# EAGLE schematic QuantumEntanglement (EAGLE 7.5.0)
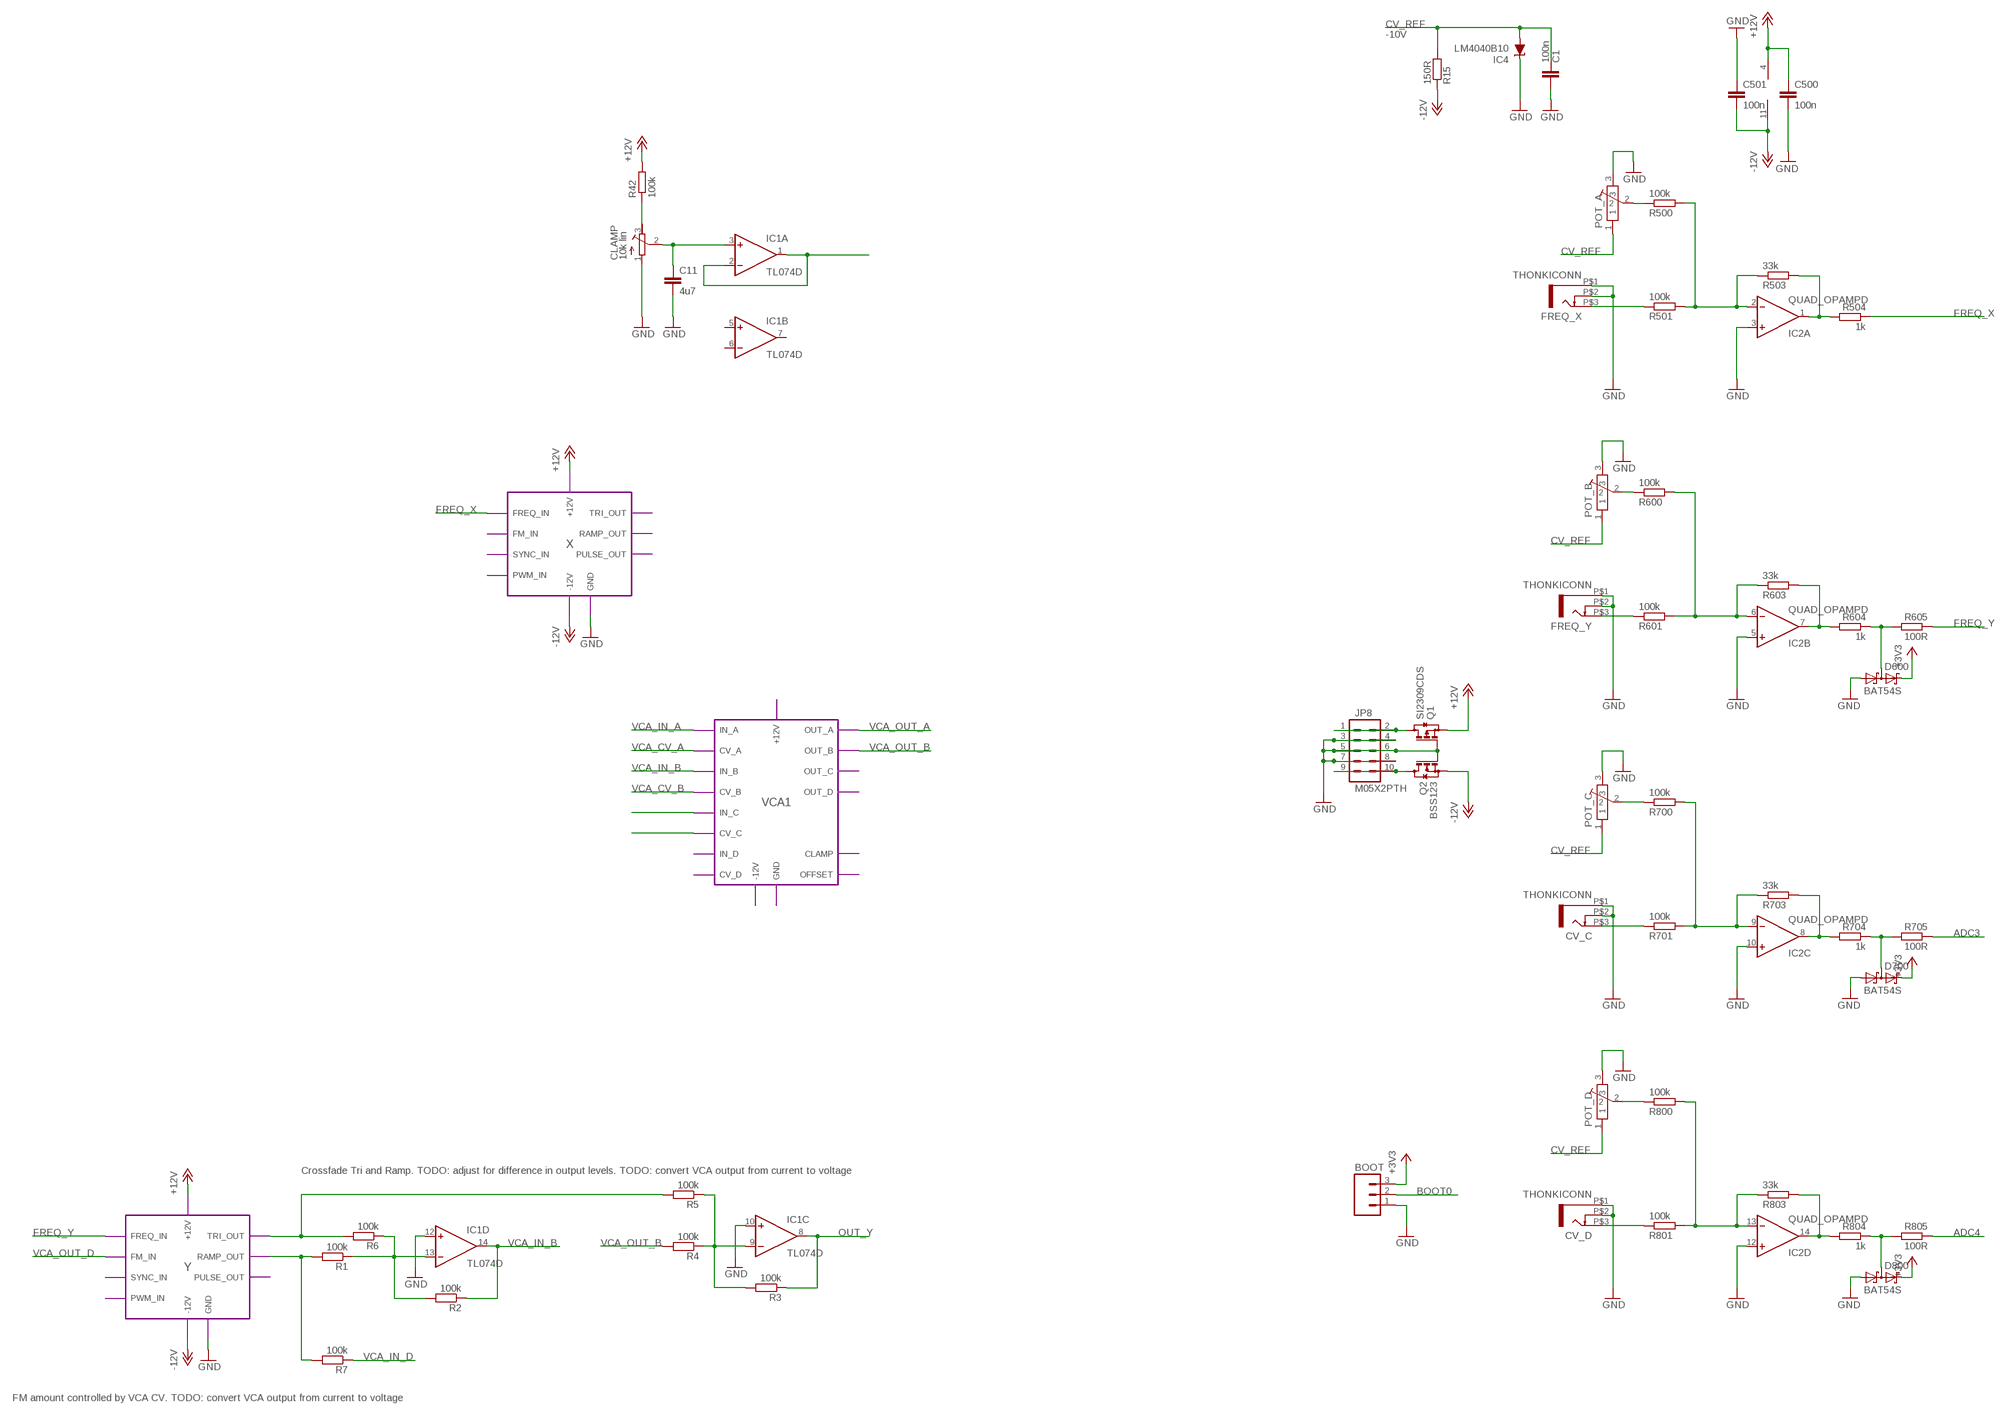
[diagram p0: schematic, sheet 1]

## Parts
BOOT  M03PTH  [1X03]
C1  100n  C-EUC0603  [C0603]
C11  4u7  C-EUC0603K  [C0603K]
C500  100n  C-EUC0603  [C0603]
C501  100n  C-EUC0603  [C0603]
CLAMP  10k lin  R-TRIMM64W  [RTRIM64W]
CV_C  THONKICONN  [THONKICONN]
CV_D  THONKICONN  [THONKICONN]
D600  BAT54S  [SOT23]
D700  BAT54S  [SOT23]
D800  BAT54S  [SOT23]
FREQ_X  THONKICONN  [THONKICONN]
FREQ_Y  THONKICONN  [THONKICONN]
IC1  TL074D  [SO14]
IC2  QUAD_OPAMPD  [SO14]
IC4  LM4040B10  LM4041C12DBZ  [DBZ_R-PDSO-G3]
JP8  M05X2PTH  [AVR_ICSP]
POT_A  POT-ALPS-RK09L1140  [POT-ALPS-RK09L1140]
POT_B  POT-ALPS-RK09L1140  [POT-ALPS-RK09L1140]
POT_C  POT-ALPS-RK09L1140  [POT-ALPS-RK09L1140]
POT_D  POT-ALPS-RK09L1140  [POT-ALPS-RK09L1140]
Q1  SI2309CDS  BSS84  [SOT23]
Q2  BSS123  [SOT23]
R1  100k  R-EU_0603  [0603]
R2  100k  R-EU_0603  [0603]
R3  100k  R-EU_0603  [0603]
R4  100k  R-EU_0603  [0603]
R5  100k  R-EU_0603  [0603]
R6  100k  R-EU_0603  [0603]
R7  100k  R-EU_0603  [0603]
R15  150R  R-EU_0603  [0603]
R42  100k  R-EU_0603  [0603]
R500  100k  R-EU_0603  [0603]
R501  100k  R-EU_0603  [0603]
R503  33k  R-EU_0603  [0603]
R504  1k  R-EU_0603  [0603]
R600  100k  R-EU_0603  [0603]
R601  100k  R-EU_0603  [0603]
R603  33k  R-EU_0603  [0603]
R604  1k  R-EU_0603  [0603]
R605  100R  R-EU_0603  [0603]
R700  100k  R-EU_0603  [0603]
R701  100k  R-EU_0603  [0603]
R703  33k  R-EU_0603  [0603]
R704  1k  R-EU_0603  [0603]
R705  100R  R-EU_0603  [0603]
R800  100k  R-EU_0603  [0603]
R801  100k  R-EU_0603  [0603]
R803  33k  R-EU_0603  [0603]
R804  1k  R-EU_0603  [0603]
R805  100R  R-EU_0603  [0603]

## Module instances
X = VCO
Y = VCO
VCA1 = VCA

## Nets
+3V3: BOOT.3 D600.2(C2) D700.2(C2) D800.2(C2)
+12V: C500.1 IC2.4(P:V+) Q1.2(S) R42.2 ; port X.+12V Y.+12V
-12V: C501.2 IC2.11(P:V-) Q2.2(S) R15.1 ; port X.-12V Y.-12V
ADC3: R705.1
ADC4: R805.1
BOOT0: BOOT.2
CLAMP_REF: IC1.1(A:OUT) IC1.2(A:-IN)
CV_REF: C1.1 IC4.2(A) POT_A.1 POT_B.1 POT_C.1 POT_D.1 R15.2
FREQ_X: R504.1 ; port X.FREQ_IN
FREQ_Y: R605.1 ; port Y.FREQ_IN
GND: BOOT.1 C1.2 C11.2 C500.2 C501.1 CLAMP.1(A) CV_C.P$1 CV_C.P$2 CV_D.P$1 CV_D.P$2 D600.1(A1) D700.1(A1) D800.1(A1) FREQ_X.P$1 FREQ_X.P$2 FREQ_Y.P$1 FREQ_Y.P$2 IC1.10(C:+IN) IC1.12(D:+IN) IC2.3(A:+IN) IC2.5(B:+IN) IC2.10(C:+IN) IC2.12(D:+IN) IC4.1(C) JP8.3 JP8.4 JP8.5 JP8.6 JP8.7 JP8.8 POT_A.3 POT_B.3 POT_C.3 POT_D.3 Q1.1(G) Q2.1(G) ; port X.GND Y.GND
N$1: R1.2 R7.2 ; port Y.RAMP_OUT
N$2: IC1.13(D:-IN) R1.1 R2.2 R6.1
N$3: FREQ_X.P$3 R501.1
N$5: IC1.9(C:-IN) R3.2 R4.1 R5.1
N$6: IC2.9(C:-IN) R700.2 R701.2 R703.1
N$8: JP8.9 JP8.10 Q2.3(D)
N$10: R5.2 R6.2 ; port Y.TRI_OUT
N$12: JP8.1 JP8.2 Q1.3(D)
N$13: IC2.2(A:-IN) R500.2 R501.2 R503.1
N$14: POT_A.2 R500.1
N$16: port VCA1.IN_C
N$17: IC2.1(A:OUT) R503.2 R504.2
N$18: port VCA1.CV_C
N$19: FREQ_Y.P$3 R601.1
N$20: IC2.6(B:-IN) R600.2 R601.2 R603.1
N$21: POT_B.2 R600.1
N$22: IC2.7(B:OUT) R603.2 R604.2
N$23: D600.3(C1A2) R604.1 R605.2
N$25: CV_C.P$3 R701.1
N$27: POT_C.2 R700.1
N$28: IC2.8(C:OUT) R703.2 R704.2
N$29: D700.3(C1A2) R704.1 R705.2
N$31: CV_D.P$3 R801.1
N$33: IC2.13(D:-IN) R800.2 R801.2 R803.1
N$34: POT_D.2 R800.1
N$35: IC2.14(D:OUT) R803.2 R804.2
N$36: D800.3(C1A2) R804.1 R805.2
N$44: CLAMP.3(E) R42.1
N$78: C11.1 CLAMP.2(S) IC1.3(A:+IN)
OUT_Y: IC1.8(C:OUT) R3.1
VCA_CV_A: port VCA1.CV_A
VCA_CV_B: port VCA1.CV_B
VCA_IN_A: port VCA1.IN_A
VCA_IN_B: IC1.14(D:OUT) R2.1 ; port VCA1.IN_B
VCA_IN_D: R7.1
VCA_OUT_A: port VCA1.OUT_A
VCA_OUT_B: R4.2 ; port VCA1.OUT_B
VCA_OUT_D: port Y.FM_IN
Unconnected: IC1.5(B:+IN) IC1.6(B:-IN) IC1.7(B:OUT) POT_A.P$5 POT_A.P$6 POT_B.P$5 POT_B.P$6 POT_C.P$5 POT_C.P$6 POT_D.P$5 POT_D.P$6

## Notes on the sheet
- -10V
- Crossfade Tri and Ramp. TODO: adjust for difference in output levels. TODO: convert VCA output from current to voltage
- FM amount controlled by VCA CV. TODO: convert VCA output from current to voltage

## Power pins joined to a net without a drawn wire
V+: IC1.4(P:V+)
V-: IC1.11(P:V-)

## Library data of the parts
BOOT = SparkFun:M03: Header 3 Standard 3-pin 0.1" header. Use with straight break away headers (SKU : PRT-00116), right angle break away headers (PRT-00553), swiss pins (PRT-00743), machine pins (PRT-00117), and female headers (PRT-00115). Molex polarized connector foot print use with SKU : PRT-08232 with associated crimp pins and housings.
C1 C11 C500 C501 = resistor:C-EU: CAPACITOR, European symbol
CLAMP = resistor:R-TRIMM: Trimm resistor
CV_C CV_D FREQ_X FREQ_Y = Rebel:THONKICONN
D600 D700 D800 = diode:BAT54S: Schottky Diodes Pin connection corrected 2011-05-04 Source: Fairchild .. BAT54.pdf
IC1 = linear:TL074: OP AMP
IC2 = adafruit:QUAD_OPAMP: OP AMP Standard quad package
IC4 = texas:LM4041: PRECISION MICROPOWER SHUNT VOLTAGE REFERENCE Source: http://focus.ti.com/lit/ds/slcs146e/slcs146e.pdf; MF: TEXAS INSTRUMENT CONNECTORS; MPN: LM4041C12QDBZT; OC_FARNELL: 1771733; OC_NEWARK: 43K3376
JP8 = SparkFun:M05X2: Header 5x2 Standard 10-pin dual row 0.1" header. Commonly used with AVR-ISP. Use with Spark Fun Electronics SKU: PRT-00778
POT_A POT_B POT_C POT_D = Rebel:POT-ALPS-RK09L
Q1 = transistor-small-signal:BSS84: P-CHANNEL MOS FET; OC_FARNELL: 1779264
Q2 = transistor-small-signal:BSS123: N-CHANNEL MOS FET; OC_FARNELL: 1843725
R1-R7 R15 R42 R500 R501 R503 R504 R600 R601 R603-R605 R700 R701 R703-R705 R800 R801 R803-R805 = Rebel:R-EU_: RESISTOR, European symbol

## Module VCO
Ports: FREQ_IN(io) FM_IN(io) SYNC_IN(io) PWM_IN(io) TRI_OUT(io) RAMP_OUT(io) PULSE_OUT(io) -12V(pwr) +12V(pwr) GND(pwr)
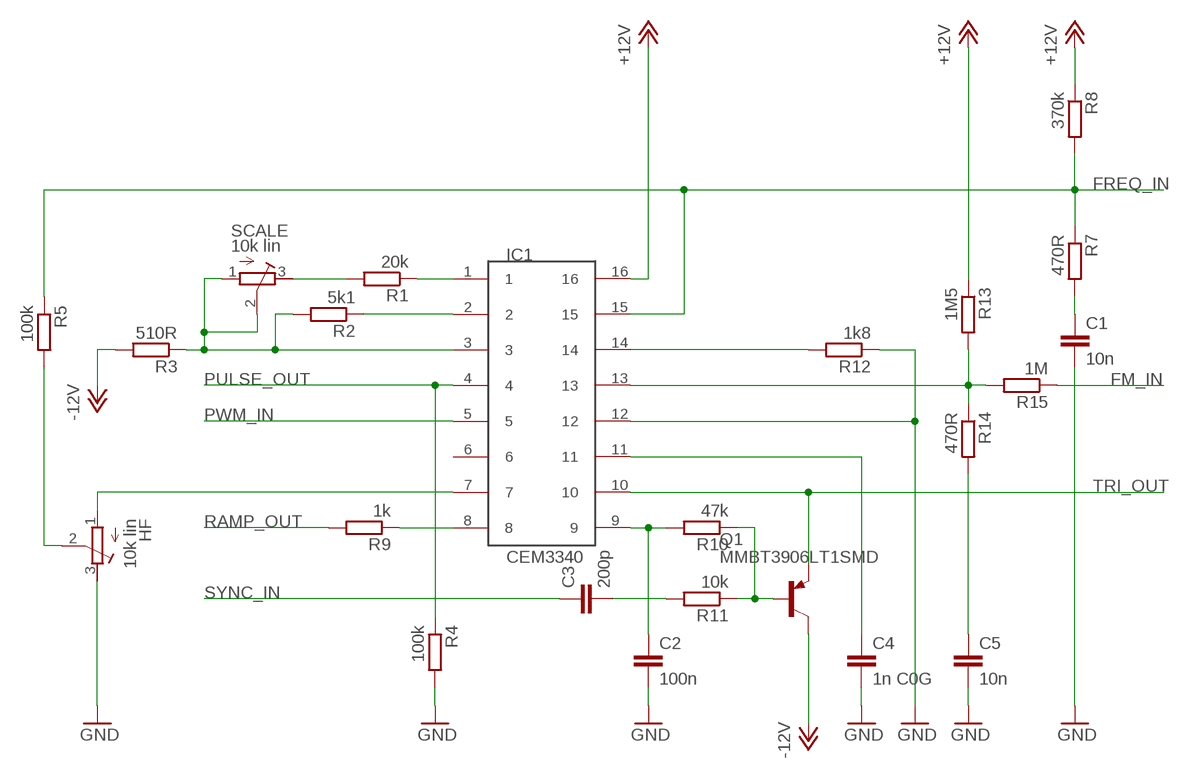
[diagram p1: schematic, module VCO, sheet 1]

### Parts
C1  10n  C-EUC0603K  [C0603K]
C2  100n  C-EUC0603K  [C0603K]
C3  200p  C-EUC0603K  [C0603K]
C4  1n C0G  C-EUC0603K  [C0603K]
C5  10n  C-EUC0603K  [C0603K]
HF  10k lin  R-TRIMM64W  [RTRIM64W]
IC1  CEM3340  [SOIC16N]
Q1  MMBT3906LT1SMD  [SOT23-BEC]
R1  20k  R-EU_0603  [0603]
R2  5k1  R-EU_0603  [0603]
R3  510R  R-EU_0603  [0603]
R4  100k  R-EU_0603  [0603]
R5  100k  R-EU_0603  [0603]
R7  470R  R-EU_0603  [0603]
R8  370k  R-EU_0603  [0603]
R9  1k  R-EU_0603  [0603]
R10  47k  R-EU_0603  [0603]
R11  10k  R-EU_0603  [0603]
R12  1k8  R-EU_0603  [0603]
R13  1M5  R-EU_0603  [0603]
R14  470R  R-EU_0603  [0603]
R15  1M  R-EU_0603  [0603]
SCALE  10k lin  R-TRIMM64W  [RTRIM64W]

### Nets
+12V: IC1.16 R8.1 R13.1
-12V: Q1.C R3.2
FM_IN: R15.1
FREQ_IN: IC1.15 R5.1 R7.1 R8.2
GND: C1.2 C2.2 C4.2 C5.2 HF.3(E) IC1.12 R4.2 R12.1
N$1: IC1.1 R1.1
N$2: R1.2 SCALE.3(E)
N$3: HF.1(A) IC1.7
N$4: IC1.2 R2.1
N$5: IC1.3 R2.2 R3.1 SCALE.1(A) SCALE.2(S)
N$6: HF.2(S) R5.2
N$9: C1.1 R7.2
N$10: IC1.8 R9.1
N$11: C2.1 IC1.9 R10.2
N$12: Q1.B R10.1 R11.1
N$13: C3.2 R11.2
N$14: C4.1 IC1.11
N$16: IC1.14 R12.2
N$17: IC1.13 R13.2 R14.1 R15.2
N$18: C5.1 R14.2
PULSE_OUT: IC1.4 R4.1
PWM_IN: IC1.5
RAMP_OUT: R9.2
SYNC_IN: C3.1
TRI_OUT: IC1.10 Q1.E
Unconnected: IC1.6

### Library data of the parts
C1-C5 = resistor:C-EU: CAPACITOR, European symbol
HF SCALE = resistor:R-TRIMM: Trimm resistor
IC1 = Rebel:CEM3340: CEM3340 VCO
Q1 = transistor-pnp:MMBT3906*: PNP Transistror
R1-R5 R7-R15 = Rebel:R-EU_: RESISTOR, European symbol

## Module VCA
Ports: IN_A(in) CV_A(in) IN_B(in) CV_B(in) IN_C(in) CV_C(in) IN_D(in) CV_D(in) OUT_A(out) OUT_B(out) OUT_C(out) OUT_D(out) CLAMP(io) OFFSET(io) +12V(pwr) -12V(pwr) GND(pwr)
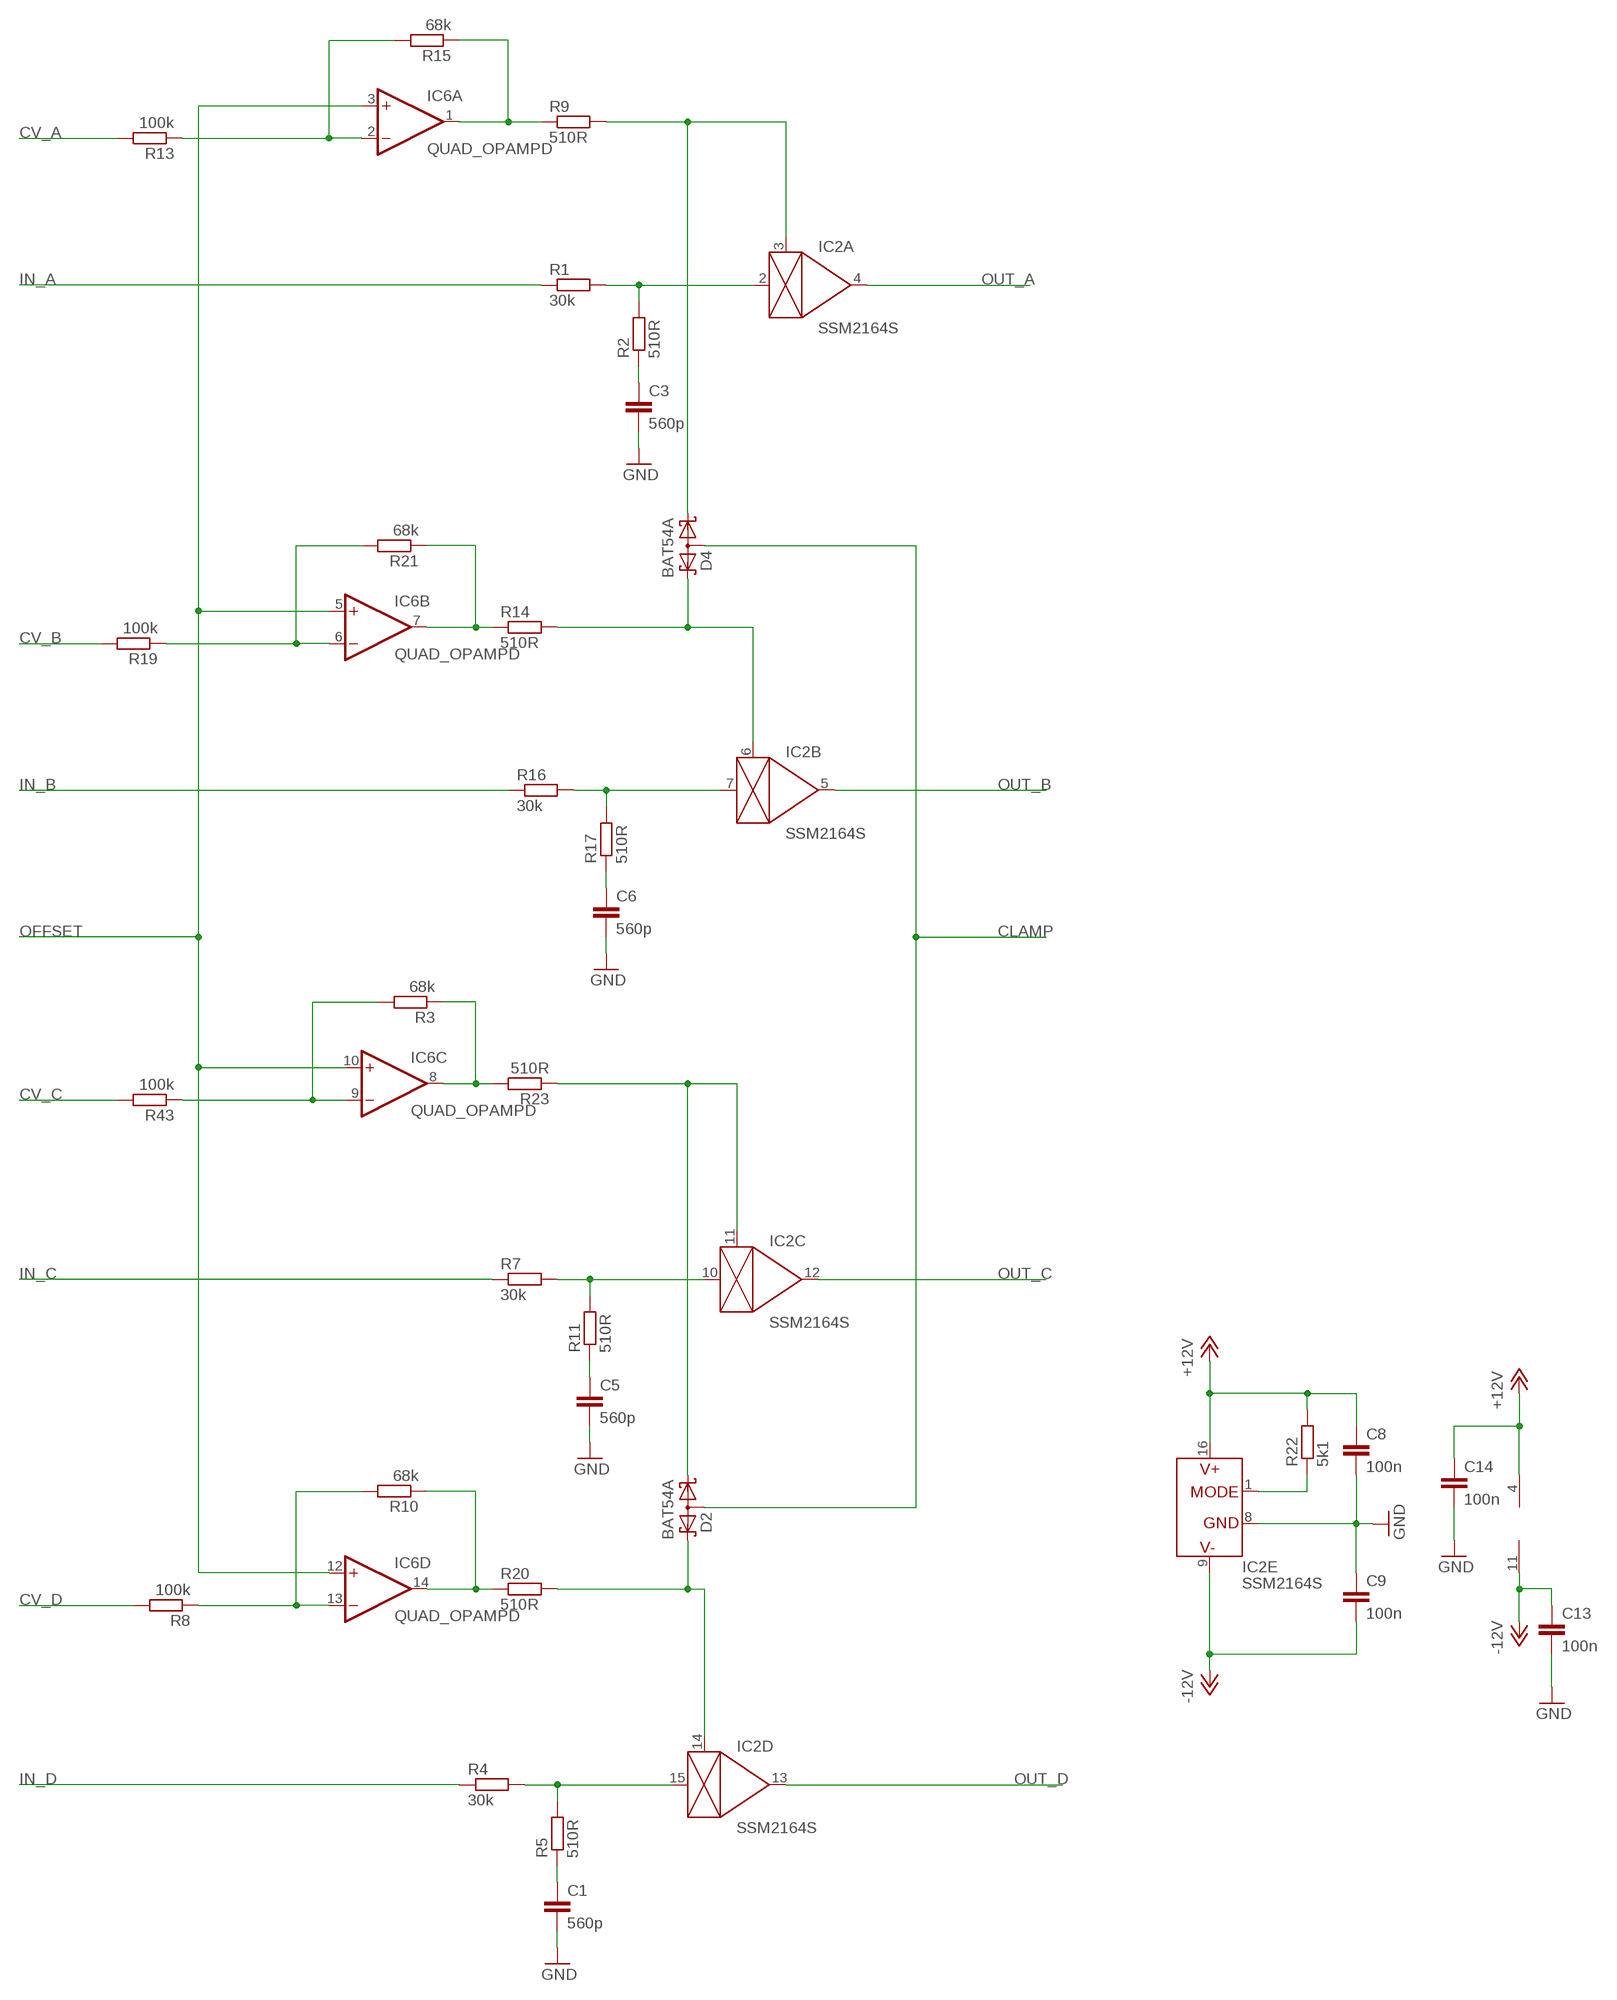
[diagram p2: schematic, module VCA, sheet 1]

### Parts
C1  560p  C-EUC0603K  [C0603K]
C3  560p  C-EUC0603K  [C0603K]
C5  560p  C-EUC0603K  [C0603K]
C6  560p  C-EUC0603K  [C0603K]
C8  100n  C-EUC0603K  [C0603K]
C9  100n  C-EUC0603K  [C0603K]
C13  100n  C-EUC0603K  [C0603K]
C14  100n  C-EUC0603K  [C0603K]
D2  BAT54A  [SOT23]
D4  BAT54A  [SOT23]
IC2  SSM2164S  [SOIC16N]
IC6  QUAD_OPAMPD  [SO14]
R1  30k  R-EU_0603  [0603]
R2  510R  R-EU_0603  [0603]
R3  68k  R-EU_0603  [0603]
R4  30k  R-EU_0603  [0603]
R5  510R  R-EU_0603  [0603]
R7  30k  R-EU_0603  [0603]
R8  100k  R-EU_0603  [0603]
R9  510R  R-EU_0603  [0603]
R10  68k  R-EU_0603  [0603]
R11  510R  R-EU_0603  [0603]
R13  100k  R-EU_0603  [0603]
R14  510R  R-EU_0603  [0603]
R15  68k  R-EU_0603  [0603]
R16  30k  R-EU_0603  [0603]
R17  510R  R-EU_0603  [0603]
R19  100k  R-EU_0603  [0603]
R20  510R  R-EU_0603  [0603]
R21  68k  R-EU_0603  [0603]
R22  5k1  R-EU_0603  [0603]
R23  510R  R-EU_0603  [0603]
R43  100k  R-EU_0603  [0603]

### Nets
+12V: C8.1 C14.1 IC2.16(E:V+) IC6.4(P:V+) R22.2
-12V: C9.2 C13.1 IC2.9(E:V-) IC6.11(P:V-)
CLAMP: D2.3(AA) D4.3(AA)
CV_A: R13.2
CV_B: R19.2
CV_C: R43.2
CV_D: R8.2
GND: C1.2 C3.2 C5.2 C6.2 C8.2 C9.1 C13.2 C14.2 IC2.8(E:GND)
IC2_1: IC6.14(D:OUT) R10.1 R20.1
IC2_2: IC6.13(D:-IN) R8.1 R10.2
IC2_3: IC6.1(A:OUT) R9.1 R15.1
IC2_4: IC6.9(C:-IN) R3.2 R43.1
IC2_5: IC6.2(A:-IN) R13.1 R15.2
IC2_6: IC6.7(B:OUT) R14.1 R21.1
IC2_7: IC6.6(B:-IN) R19.1 R21.2
IC2_11: IC6.8(C:OUT) R3.1 R23.2
IN_A: R1.1
IN_B: R16.1
IN_C: R7.1
IN_D: R4.1
N$1: D4.1(K1) IC2.3(A:CTRL) R9.2
N$2: C1.1 R5.1
N$3: C3.1 R2.1
N$4: IC2.15(D:IN) R4.2 R5.2
N$5: IC2.2(A:IN) R1.2 R2.2
N$7: D4.2(K2) IC2.6(B:CTRL) R14.2
N$8: D2.1(K1) IC2.11(C:CTRL) R23.1
N$11: C6.1 R17.1
N$12: IC2.7(B:IN) R16.2 R17.2
N$14: D2.2(K2) IC2.14(D:CTRL) R20.2
N$17: IC2.1(E:MODE) R22.1
N$19: C5.1 R11.1
N$23: IC2.10(C:IN) R7.2 R11.2
OFFSET: IC6.3(A:+IN) IC6.5(B:+IN) IC6.10(C:+IN) IC6.12(D:+IN)
OUT_A: IC2.4(A:OUT)
OUT_B: IC2.5(B:OUT)
OUT_C: IC2.12(C:OUT)
OUT_D: IC2.13(D:OUT)

### Library data of the parts
C1 C3 C5 C6 = resistor:C-EU: CAPACITOR, European symbol
C8 C9 C13 C14 = Rebel:C-EU: CAPACITOR, European symbol
D2 D4 = diode:BAT54A: Schottky Diodes Source: Fairchild .. BAT54.pdf
IC2 = ssm2164:SSM2164
IC6 = adafruit:QUAD_OPAMP: OP AMP Standard quad package
R1-R5 R7-R11 R13-R17 R19-R23 R43 = Rebel:R-EU_: RESISTOR, European symbol